# Altium schematic sheet Precharge_Fail.SchDoc
size A
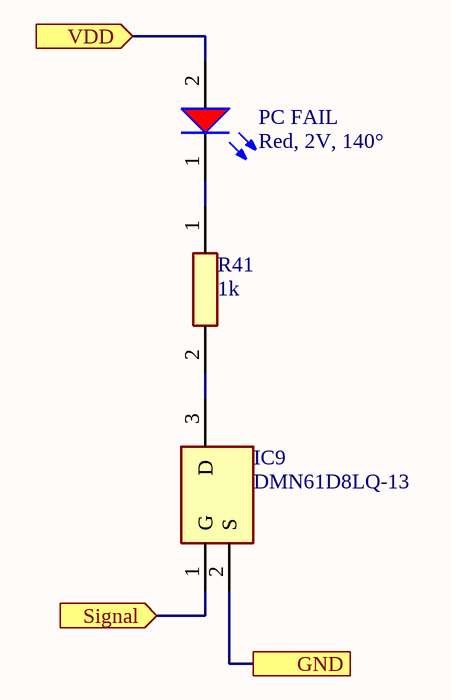
[diagram p0: Precharge_Fail.SchDoc]

## Parts
IC9  DMN61D8LQ-13  [SOT96P240X110-3N]
PC_FAIL  Red, 2V, 140°  [WL-SMRW_1206 rectangular_normal use]
R41  1k  [RESC3116X65N]

## Ports
GND, Signal (in), VDD (in)

## Nets
GND: IC9.2(S) ; port GND
Signal: IC9.1(G) ; port Signal
VDD: PC_FAIL.2(A) ; port VDD
NetIC9_3: IC9.3(D) R41.2
NetPC_FAIL_1: PC_FAIL.1(K) R41.1

## Library data of the parts
IC9 = DMN61D8LQ-13: Integrated Circuit; Manufacturer_Name: Diodes Incorporated; Datasheet Link: https://www.diodes.com//assets/Datasheets/DMN61D8LQ.pdf; Height: 1.1mm; Manufacturer_Part_Number: DMN61D8LQ-13; Mouser Part Number: 621-DMN61D8LQ-13; Mouser Price/Stock: https://www.mouser.co.uk/ProductDetail/Diodes-Incorporated/DMN61D8LQ-13?qs=DBvH5xl4UymJgoulTjiNCg%3D%3D; Arrow Part Number: DMN61D8LQ-13; Arrow Price/Stock: https://www.arrow.com/en/products/dmn61d8lq-13/diodes-incorporated?utm_currency=USD&region=nac
PC_FAIL = 156120RS75000: WL-SMRW Mono-color Reverse mount Waterclear, SMT, size 1206 rectangular, Red, 2V, 140°; Manufacturer: Wurth Elektronik; Chip Technology: AlInGaP; Dominant Wavelength: 624nm; Luminous Intensity: 60mcd; Peak Wavelength: 632nm; Manufacturer Part Number: 156120RS75000; Category: Signal LEDs; Match Code: WL-SMRW; ComponentLink1Description: Website Link; ComponentLink1URL: https://www.we-online.com/redexpert/article/156120RS75000?ad; ComponentLink2Description: Datasheet Link; ComponentLink2URL: https://www.we-online.com/redexpert/spec/156120RS75000?ad; Mount: Surface Mount; Operating Temperature Max: 85°C; Operating Temperature Min: -40°C; Packaging: Tape and Reel; Case/Size Code: 1206 rectangular; Length: 3.2mm; Width: 1.6mm; Height: 1.2mm; Emitting Color: Red; Forward Voltage: 2V; Viewing Angle: 140°
R41 = CRGS1206J1K0: Resistor; Manufacturer_Name: TE Connectivity; Datasheet Link: https://www.te.com/commerce/DocumentDelivery/DDEController?Action=srchrtrv&DocNm=9-1773463-8&DocType=Data%20Sheet&DocLang=English&PartCntxt=3-2176245-7&DocFormat=pdf; Height: 0.65mm; Manufacturer_Part_Number: CRGS1206J1K0; Mouser Part Number: 279-CRGS1206J1K0; Mouser Price/Stock: https://www.mouser.com/Search/Refine.aspx?Keyword=279-CRGS1206J1K0